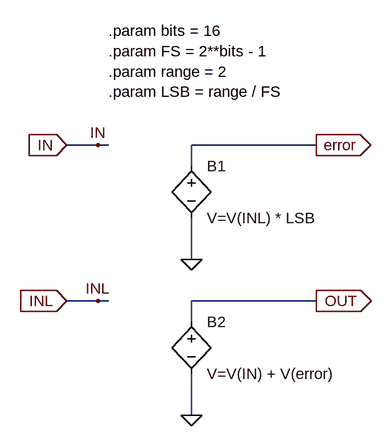
[diagram p0: schematic Add_INL.asc]
Add_INL.asc, the LTspice schematic file:
Version 4
SHEET 1 880 680
WIRE 128 128 80 128
WIRE 144 128 128 128
WIRE 464 128 272 128
WIRE 272 160 272 128
WIRE 272 304 272 240
WIRE 128 368 80 368
WIRE 144 368 128 368
WIRE 464 368 272 368
WIRE 272 400 272 368
WIRE 272 544 272 480
FLAG 80 128 IN
IOPIN 80 128 In
FLAG 80 368 INL
IOPIN 80 368 In
FLAG 464 128 error
IOPIN 464 128 Out
FLAG 272 304 0
FLAG 464 368 OUT
IOPIN 464 368 Out
FLAG 272 544 0
FLAG 128 128 IN
FLAG 128 368 INL
SYMBOL bv 272 144 R0
SYMATTR InstName B1
SYMATTR Value V=V(INL) * LSB
SYMBOL bv 272 384 R0
SYMATTR InstName B2
SYMATTR Value V=V(IN) + V(error)
TEXT 144 -48 Left 2 !.param bits = 16\n.param FS = 2**bits - 1\n.param range = 2\n.param LSB = range / FS

The netlist it stands for:
* Add_INL.asc
B1 error 0 V=V(INL) * LSB
B2 OUT 0 V=V(IN) + V(error)
.param bits = 16
.param FS = 2**bits - 1
.param range = 2
.param LSB = range / FS
.backanno
.end